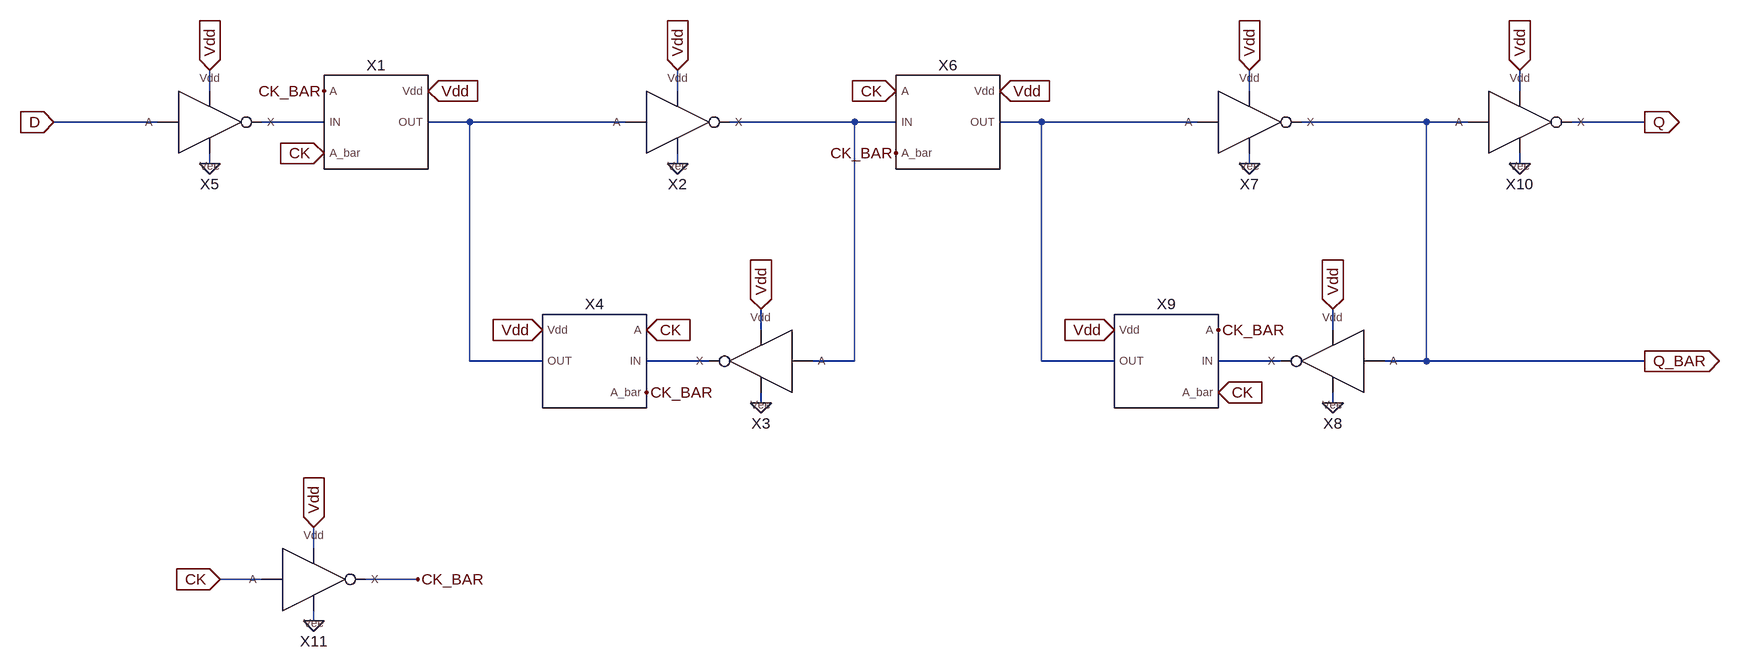
[diagram p0: schematic DFF_tweaked.asc]
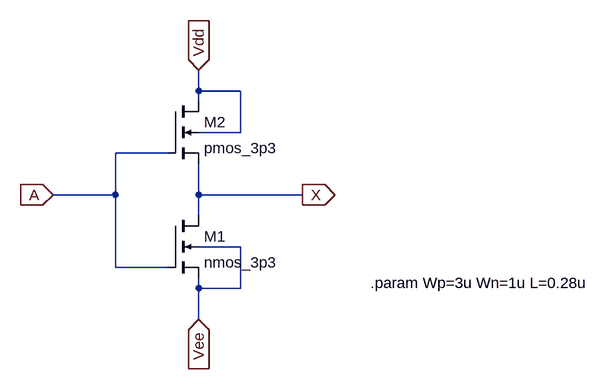
[diagram p1: sub-circuit invx1.asc]
DFF_tweaked.asc, the LTspice schematic file:
Version 4.1
SHEET 1 2564 864
WIRE -64 0 -64 -32
WIRE 656 0 656 -32
WIRE 1536 0 1536 -32
WIRE 1952 0 1952 -32
WIRE -144 48 -304 48
WIRE 112 48 16 48
WIRE 336 48 272 48
WIRE 576 48 336 48
WIRE 928 48 736 48
WIRE 992 48 928 48
WIRE 1216 48 1152 48
WIRE 1456 48 1216 48
WIRE 1808 48 1616 48
WIRE 1872 48 1808 48
WIRE 2144 48 2032 48
WIRE -64 112 -64 96
WIRE 656 112 656 96
WIRE 1536 112 1536 96
WIRE 1952 112 1952 96
WIRE 784 368 784 336
WIRE 1664 368 1664 336
WIRE 336 416 336 48
WIRE 448 416 336 416
WIRE 704 416 608 416
WIRE 928 416 928 48
WIRE 928 416 864 416
WIRE 1216 416 1216 48
WIRE 1328 416 1216 416
WIRE 1584 416 1488 416
WIRE 1808 416 1808 48
WIRE 1808 416 1744 416
WIRE 2144 416 1808 416
WIRE 784 480 784 464
WIRE 1664 480 1664 464
WIRE 96 704 96 672
WIRE 16 752 -48 752
WIRE 256 752 176 752
WIRE 96 816 96 800
FLAG -64 -32 Vdd
IOPIN -64 -32 In
FLAG -64 112 0
FLAG -304 48 D
IOPIN -304 48 In
FLAG 2144 48 Q
IOPIN 2144 48 Out
FLAG 656 -32 Vdd
IOPIN 656 -32 In
FLAG 656 112 0
FLAG 784 336 Vdd
IOPIN 784 336 In
FLAG 784 480 0
FLAG 1536 -32 Vdd
IOPIN 1536 -32 In
FLAG 1536 112 0
FLAG 1664 336 Vdd
IOPIN 1664 336 In
FLAG 1664 480 0
FLAG 1952 -32 Vdd
IOPIN 1952 -32 In
FLAG 1952 112 0
FLAG 2144 416 Q_BAR
IOPIN 2144 416 Out
FLAG 1152 0 Vdd
IOPIN 1152 0 In
FLAG 448 368 Vdd
IOPIN 448 368 In
FLAG 1328 368 Vdd
IOPIN 1328 368 In
FLAG 272 0 Vdd
IOPIN 272 0 In
FLAG 112 96 CK
IOPIN 112 96 In
FLAG 608 368 CK
IOPIN 608 368 In
FLAG 1488 464 CK
IOPIN 1488 464 In
FLAG 992 0 CK
IOPIN 992 0 In
FLAG 112 0 CK_BAR
FLAG 608 464 CK_BAR
FLAG 992 96 CK_BAR
FLAG 1488 368 CK_BAR
FLAG 96 672 Vdd
IOPIN 96 672 In
FLAG 96 816 0
FLAG -48 752 CK
IOPIN -48 752 In
FLAG 256 752 CK_BAR
SYMBOL INVx1 -64 48 R0
SYMATTR InstName X5
SYMBOL INVx1 656 48 R0
SYMATTR InstName X2
SYMBOL INVx1 784 416 M0
SYMATTR InstName X3
SYMBOL TGATE 528 416 M0
SYMATTR InstName X4
SYMATTR SpiceLine .param L=0.28u Wn={1u/2} Wp={3u/2} M=1
SYMBOL TGATE 1072 48 R0
SYMATTR InstName X6
SYMATTR SpiceLine .param L=0.28u Wn={1u/2} Wp={3u/2} M=1
SYMBOL INVx1 1536 48 R0
SYMATTR InstName X7
SYMBOL INVx1 1664 416 M0
SYMATTR InstName X8
SYMBOL TGATE 1408 416 M0
SYMATTR InstName X9
SYMATTR SpiceLine .param L=0.28u Wn={1u/2} Wp={3u/2} M=1
SYMBOL INVx1 1952 48 R0
SYMATTR InstName X10
SYMBOL INVx1 96 752 R0
SYMATTR InstName X11
SYMBOL tgate 192 48 R0
SYMATTR InstName X1
SYMATTR SpiceLine .param L=0.28u Wn={1u/2} Wp={3u/2} M=1

invx1.asc, the sub-circuit schematic file:
Version 4
SHEET 1 2776 836
WIRE 416 -16 416 -48
WIRE 480 -16 416 -16
WIRE 416 0 416 -16
WIRE 480 48 480 -16
WIRE 480 48 416 48
WIRE 368 80 288 80
WIRE 288 144 288 80
WIRE 288 144 192 144
WIRE 416 144 416 96
WIRE 576 144 416 144
WIRE 416 176 416 144
WIRE 480 224 416 224
WIRE 288 256 288 144
WIRE 368 256 288 256
WIRE 416 288 416 272
WIRE 480 288 480 224
WIRE 480 288 416 288
WIRE 416 336 416 288
FLAG 416 -48 Vdd
IOPIN 416 -48 In
FLAG 192 144 A
IOPIN 192 144 In
FLAG 576 144 X
IOPIN 576 144 Out
FLAG 416 336 Vee
IOPIN 416 336 In
SYMBOL nmos4 368 176 R0
SYMATTR InstName M1
SYMATTR Value nmos_3p3
SYMATTR Value2 l={L} w={Wn}
SYMBOL nmos4 368 0 R0
SYMATTR InstName M2
SYMATTR Value pmos_3p3
SYMATTR Value2 l={L} w={Wp}
TEXT 680 280 Left 2 !.param Wp=3u Wn=1u L=0.28u

The netlist it stands for:
* DFF_tweaked.asc
X§X5 D Vdd N001 0 invx1
X§X2 N002 Vdd N003 0 invx1
X§X3 N003 Vdd N005 0 invx1
X§X4 CK CK_BAR N005 Vdd N002 TGATE .param L=0.28u Wn={1u/2} Wp={3u/2} M=1  ; pins A A_bar IN Vdd OUT
X§X6 CK CK_BAR N003 Vdd N004 TGATE .param L=0.28u Wn={1u/2} Wp={3u/2} M=1  ; pins A A_bar IN Vdd OUT
X§X7 N004 Vdd Q_BAR 0 invx1
X§X8 Q_BAR Vdd N006 0 invx1
X§X9 CK_BAR CK N006 Vdd N004 TGATE .param L=0.28u Wn={1u/2} Wp={3u/2} M=1  ; pins A A_bar IN Vdd OUT
X§X10 Q_BAR Vdd Q 0 invx1
X§X11 CK Vdd CK_BAR 0 invx1
X§X1 CK_BAR CK N001 Vdd N002 tgate .param L=0.28u Wn={1u/2} Wp={3u/2} M=1  ; pins A A_bar IN Vdd OUT

* block symbol definitions
.subckt invx1 A Vdd X Vee
M1 X A Vee Vee nmos_3p3 l={L} w={Wn}
M2 Vdd A X Vdd pmos_3p3 l={L} w={Wp}
.param Wp=3u Wn=1u L=0.28u
.ends invx1

.model NMOS NMOS
.model PMOS PMOS
.lib standard.mos
.backanno
.end